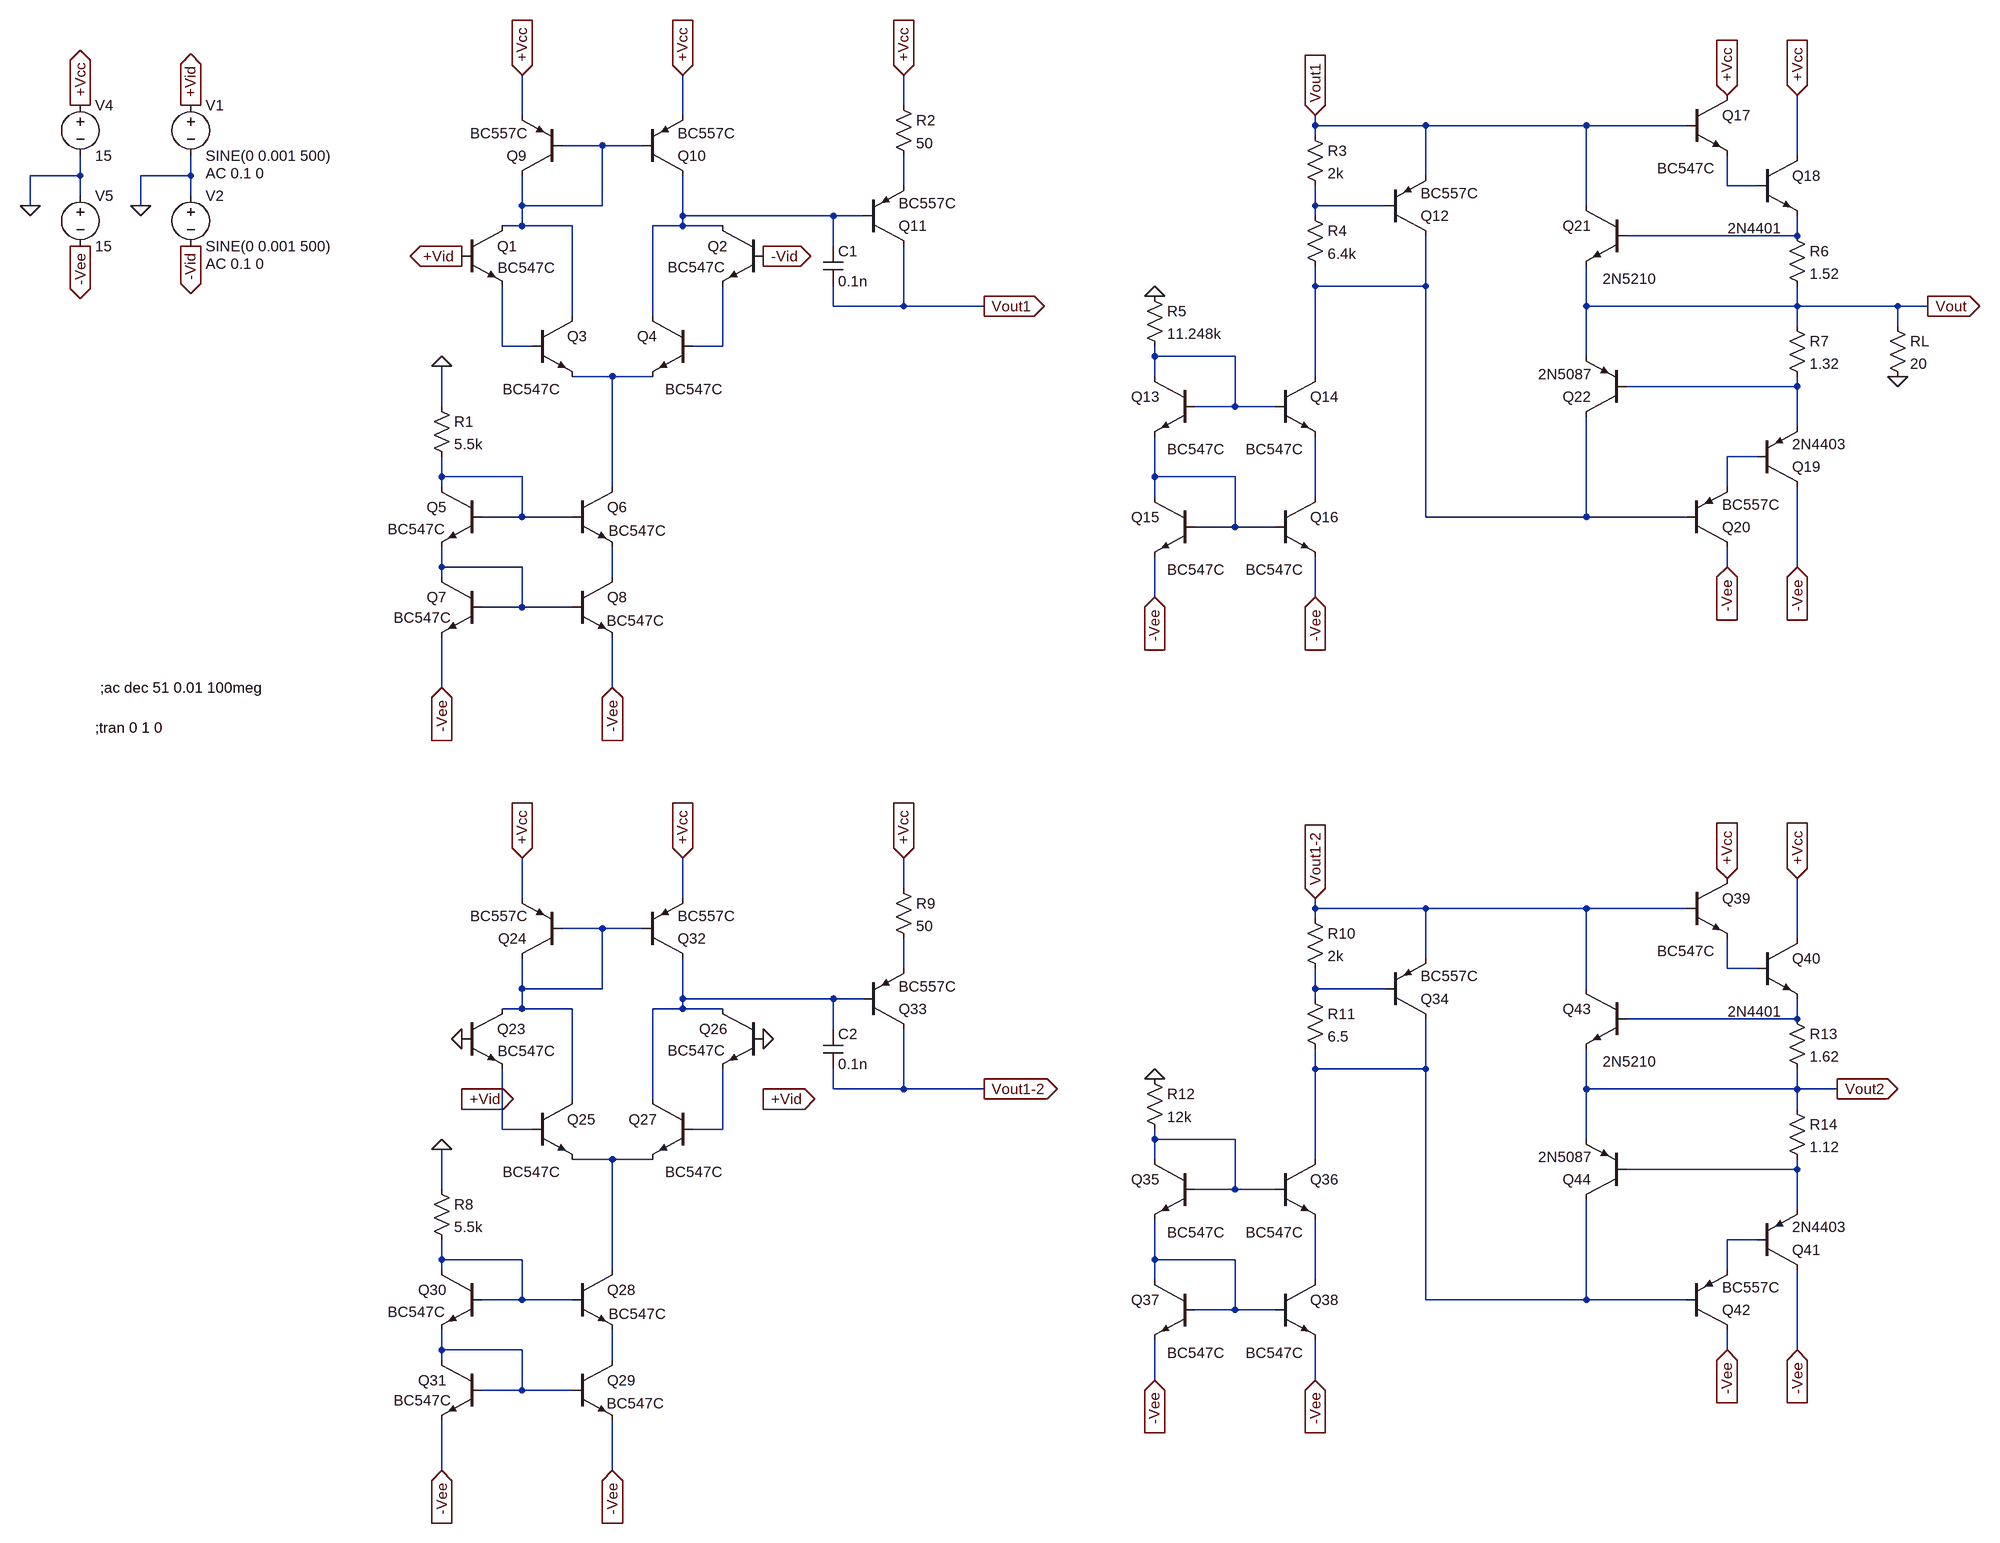
[diagram p0: schematic amplificador.asc]
amplificador.asc, the LTspice schematic file:
Version 4
SHEET 1 2160 3252
WIRE 288 944 288 896
WIRE -320 960 -320 896
WIRE -64 960 -64 896
WIRE 944 976 944 960
WIRE 1120 976 944 976
WIRE 1376 976 1120 976
WIRE 1536 976 1376 976
WIRE 944 992 944 976
WIRE -192 1008 -256 1008
WIRE -128 1008 -192 1008
WIRE 1712 1024 1712 928
WIRE -1024 1056 -1024 1024
WIRE -1024 1056 -1104 1056
WIRE -848 1056 -848 1024
WIRE -848 1056 -928 1056
WIRE 1120 1056 1120 976
WIRE 288 1072 288 1024
WIRE 1600 1072 1600 1024
WIRE 1648 1072 1600 1072
WIRE -1024 1088 -1024 1056
WIRE -848 1088 -848 1056
WIRE -1104 1104 -1104 1056
WIRE -928 1104 -928 1056
WIRE -320 1104 -320 1056
WIRE -192 1104 -192 1008
WIRE -192 1104 -320 1104
WIRE 944 1104 944 1072
WIRE 1056 1104 944 1104
WIRE 1376 1104 1376 976
WIRE -64 1120 -64 1056
WIRE 176 1120 -64 1120
WIRE 224 1120 176 1120
WIRE 944 1120 944 1104
WIRE -320 1136 -320 1104
WIRE -320 1136 -352 1136
WIRE -240 1136 -320 1136
WIRE -64 1136 -64 1120
WIRE -64 1136 -112 1136
WIRE 0 1136 -64 1136
WIRE 1712 1152 1712 1120
WIRE 1712 1152 1440 1152
WIRE 176 1168 176 1120
WIRE 944 1232 944 1200
WIRE 1120 1232 1120 1152
WIRE 1120 1232 944 1232
WIRE 176 1264 176 1232
WIRE 288 1264 288 1168
WIRE 288 1264 176 1264
WIRE 416 1264 288 1264
WIRE 1376 1264 1376 1200
WIRE 1712 1264 1712 1232
WIRE 1712 1264 1376 1264
WIRE 1872 1264 1712 1264
WIRE 1920 1264 1872 1264
WIRE -240 1280 -240 1136
WIRE -112 1280 -112 1136
WIRE 1712 1296 1712 1264
WIRE 1872 1296 1872 1264
WIRE -352 1328 -352 1232
WIRE -304 1328 -352 1328
WIRE 0 1328 0 1232
WIRE 0 1328 -48 1328
WIRE 688 1344 688 1328
WIRE 816 1344 688 1344
WIRE 1376 1344 1376 1264
WIRE -176 1376 -240 1376
WIRE -112 1376 -176 1376
WIRE 688 1376 688 1344
WIRE 944 1376 944 1232
WIRE 1712 1392 1712 1376
WIRE 1712 1392 1440 1392
WIRE -448 1424 -448 1360
WIRE 816 1424 816 1344
WIRE 816 1424 752 1424
WIRE 880 1424 816 1424
WIRE 1712 1456 1712 1392
WIRE 1648 1504 1600 1504
WIRE -448 1536 -448 1504
WIRE -320 1536 -448 1536
WIRE 688 1536 688 1472
WIRE 816 1536 688 1536
WIRE -448 1552 -448 1536
WIRE -176 1552 -176 1376
WIRE 1600 1552 1600 1504
WIRE 688 1568 688 1536
WIRE 944 1568 944 1472
WIRE -320 1600 -320 1536
WIRE -320 1600 -384 1600
WIRE -240 1600 -320 1600
WIRE 1120 1600 1120 1232
WIRE 1376 1600 1376 1440
WIRE 1376 1600 1120 1600
WIRE 1536 1600 1376 1600
WIRE 816 1616 816 1536
WIRE 816 1616 752 1616
WIRE 880 1616 816 1616
WIRE -448 1680 -448 1648
WIRE -320 1680 -448 1680
WIRE 1600 1680 1600 1648
WIRE 1712 1680 1712 1552
WIRE -448 1696 -448 1680
WIRE -176 1696 -176 1648
WIRE 688 1728 688 1664
WIRE 944 1728 944 1664
WIRE -320 1744 -320 1680
WIRE -320 1744 -384 1744
WIRE -240 1744 -320 1744
WIRE -448 1872 -448 1792
WIRE -176 1872 -176 1792
WIRE 288 2192 288 2144
WIRE -320 2208 -320 2144
WIRE -64 2208 -64 2144
WIRE 944 2224 944 2208
WIRE 1120 2224 944 2224
WIRE 1376 2224 1120 2224
WIRE 1536 2224 1376 2224
WIRE 944 2240 944 2224
WIRE -192 2256 -256 2256
WIRE -128 2256 -192 2256
WIRE 1712 2272 1712 2176
WIRE 1120 2304 1120 2224
WIRE 288 2320 288 2272
WIRE 1600 2320 1600 2272
WIRE 1648 2320 1600 2320
WIRE -320 2352 -320 2304
WIRE -192 2352 -192 2256
WIRE -192 2352 -320 2352
WIRE 944 2352 944 2320
WIRE 1056 2352 944 2352
WIRE 1376 2352 1376 2224
WIRE -64 2368 -64 2304
WIRE 176 2368 -64 2368
WIRE 224 2368 176 2368
WIRE 944 2368 944 2352
WIRE -320 2384 -320 2352
WIRE -320 2384 -352 2384
WIRE -240 2384 -320 2384
WIRE -64 2384 -64 2368
WIRE -64 2384 -112 2384
WIRE 0 2384 -64 2384
WIRE 1712 2400 1712 2368
WIRE 1712 2400 1440 2400
WIRE 176 2416 176 2368
WIRE 944 2480 944 2448
WIRE 1120 2480 1120 2400
WIRE 1120 2480 944 2480
WIRE 176 2512 176 2480
WIRE 288 2512 288 2416
WIRE 288 2512 176 2512
WIRE 416 2512 288 2512
WIRE 1376 2512 1376 2448
WIRE 1712 2512 1712 2480
WIRE 1712 2512 1376 2512
WIRE 1776 2512 1712 2512
WIRE -240 2528 -240 2384
WIRE -112 2528 -112 2384
WIRE 1712 2544 1712 2512
WIRE -352 2576 -352 2480
WIRE -304 2576 -352 2576
WIRE 0 2576 0 2480
WIRE 0 2576 -48 2576
WIRE 688 2592 688 2576
WIRE 816 2592 688 2592
WIRE 1376 2592 1376 2512
WIRE -176 2624 -240 2624
WIRE -112 2624 -176 2624
WIRE 688 2624 688 2592
WIRE 944 2624 944 2480
WIRE 1712 2640 1712 2624
WIRE 1712 2640 1440 2640
WIRE -448 2672 -448 2608
WIRE 816 2672 816 2592
WIRE 816 2672 752 2672
WIRE 880 2672 816 2672
WIRE 1712 2704 1712 2640
WIRE 1648 2752 1600 2752
WIRE -448 2784 -448 2752
WIRE -320 2784 -448 2784
WIRE 688 2784 688 2720
WIRE 816 2784 688 2784
WIRE -448 2800 -448 2784
WIRE -176 2800 -176 2624
WIRE 1600 2800 1600 2752
WIRE 688 2816 688 2784
WIRE 944 2816 944 2720
WIRE -320 2848 -320 2784
WIRE -320 2848 -384 2848
WIRE -240 2848 -320 2848
WIRE 1120 2848 1120 2480
WIRE 1376 2848 1376 2688
WIRE 1376 2848 1120 2848
WIRE 1536 2848 1376 2848
WIRE 816 2864 816 2784
WIRE 816 2864 752 2864
WIRE 880 2864 816 2864
WIRE -448 2928 -448 2896
WIRE -320 2928 -448 2928
WIRE 1600 2928 1600 2896
WIRE 1712 2928 1712 2800
WIRE -448 2944 -448 2928
WIRE -176 2944 -176 2896
WIRE 688 2976 688 2912
WIRE 944 2976 944 2912
WIRE -320 2992 -320 2928
WIRE -320 2992 -384 2992
WIRE -240 2992 -320 2992
WIRE -448 3120 -448 3040
WIRE -176 3120 -176 3040
FLAG -1024 1168 -Vee
IOPIN -1024 1168 Out
FLAG -1024 944 +Vcc
IOPIN -1024 944 Out
FLAG -448 1360 0
FLAG -64 896 +Vcc
IOPIN -64 896 In
FLAG 416 1264 Vout1
IOPIN 416 1264 Out
FLAG -848 1168 -Vid
IOPIN -848 1168 Out
FLAG -848 944 +Vid
IOPIN -848 944 Out
FLAG -928 1104 0
FLAG -1104 1104 0
FLAG -320 896 +Vcc
IOPIN -320 896 In
FLAG 288 896 +Vcc
IOPIN 288 896 In
FLAG -176 1872 -Vee
IOPIN -176 1872 In
FLAG -448 1872 -Vee
IOPIN -448 1872 In
FLAG 944 960 Vout1
IOPIN 944 960 In
FLAG 688 1248 0
FLAG 1712 928 +Vcc
IOPIN 1712 928 In
FLAG 1712 1680 -Vee
IOPIN 1712 1680 In
FLAG 1920 1264 Vout
IOPIN 1920 1264 Out
FLAG 944 1728 -Vee
IOPIN 944 1728 In
FLAG 688 1728 -Vee
IOPIN 688 1728 In
FLAG 1600 928 +Vcc
IOPIN 1600 928 In
FLAG 1600 1680 -Vee
IOPIN 1600 1680 In
FLAG -448 2608 0
FLAG -64 2144 +Vcc
IOPIN -64 2144 In
FLAG 416 2512 Vout1-2
IOPIN 416 2512 Out
FLAG -320 2144 +Vcc
IOPIN -320 2144 In
FLAG 288 2144 +Vcc
IOPIN 288 2144 In
FLAG -176 3120 -Vee
IOPIN -176 3120 In
FLAG -448 3120 -Vee
IOPIN -448 3120 In
FLAG 944 2208 Vout1-2
IOPIN 944 2208 In
FLAG 688 2496 0
FLAG 1712 2176 +Vcc
IOPIN 1712 2176 In
FLAG 1712 2928 -Vee
IOPIN 1712 2928 In
FLAG 1776 2512 Vout2
IOPIN 1776 2512 Out
FLAG 944 2976 -Vee
IOPIN 944 2976 In
FLAG 688 2976 -Vee
IOPIN 688 2976 In
FLAG 1600 2176 +Vcc
IOPIN 1600 2176 In
FLAG 1600 2928 -Vee
IOPIN 1600 2928 In
FLAG -416 1184 +Vid
IOPIN -416 1184 Out
FLAG 64 1184 -Vid
IOPIN 64 1184 Out
FLAG -416 2528 +Vid
IOPIN -416 2528 Out
FLAG 64 2528 +Vid
IOPIN 64 2528 Out
FLAG -416 2432 0
FLAG 64 2432 0
FLAG 1872 1376 0
SYMBOL npn -416 1136 R0
WINDOW 3 57 67 Left 2
SYMATTR Value BC547C
SYMATTR InstName Q1
SYMBOL pnp -256 1056 R180
SYMATTR InstName Q9
SYMATTR Value BC557C
SYMBOL voltage -1024 928 R0
WINDOW 123 0 0 Left 0
WINDOW 39 0 0 Left 0
SYMATTR InstName V4
SYMATTR Value 15
SYMBOL voltage -1024 1072 R0
WINDOW 123 0 0 Left 0
WINDOW 39 0 0 Left 0
SYMATTR InstName V5
SYMATTR Value 15
SYMBOL npn -304 1280 R0
WINDOW 3 -47 116 Left 2
SYMATTR Value BC547C
SYMATTR InstName Q3
SYMBOL npn 64 1136 M0
WINDOW 3 61 66 Left 2
SYMATTR Value BC547C
SYMATTR InstName Q2
SYMBOL npn -48 1280 M0
WINDOW 3 -47 116 Left 2
SYMATTR Value BC547C
SYMATTR InstName Q4
SYMBOL npn -240 1552 R0
WINDOW 3 58 70 Left 2
SYMATTR Value BC547C
SYMATTR InstName Q6
SYMBOL npn -240 1696 R0
WINDOW 3 55 69 Left 2
SYMATTR Value BC547C
SYMATTR InstName Q8
SYMBOL npn -384 1552 M0
WINDOW 3 59 67 Left 2
SYMATTR Value BC547C
SYMATTR InstName Q5
SYMBOL npn -384 1696 M0
WINDOW 3 50 64 Left 2
SYMATTR Value BC547C
SYMATTR InstName Q7
SYMBOL res -464 1408 R0
SYMATTR InstName R1
SYMATTR Value 5.5k
SYMBOL pnp -128 1056 M180
SYMATTR InstName Q10
SYMATTR Value BC557C
SYMBOL pnp 224 1168 M180
SYMATTR InstName Q11
SYMATTR Value BC557C
SYMBOL cap 160 1168 R0
SYMATTR InstName C1
SYMATTR Value 0.1n
SYMBOL res 272 928 R0
SYMATTR InstName R2
SYMATTR Value 50
SYMBOL voltage -848 928 R0
WINDOW 123 24 124 Left 2
WINDOW 39 0 0 Left 0
SYMATTR Value2 AC 0.1 0
SYMATTR InstName V1
SYMATTR Value SINE(0 0.001 500)
SYMBOL voltage -848 1072 R0
WINDOW 123 24 124 Left 2
WINDOW 39 0 0 Left 0
SYMATTR Value2 AC 0.1 0
SYMATTR InstName V2
SYMATTR Value SINE(0 0.001 500)
SYMBOL res 928 976 R0
SYMATTR InstName R3
SYMATTR Value 2k
SYMBOL res 928 1104 R0
SYMATTR InstName R4
SYMATTR Value 6.4k
SYMBOL pnp 1056 1152 M180
SYMATTR InstName Q12
SYMATTR Value BC557C
SYMBOL npn 752 1376 M0
WINDOW 3 -47 116 Left 2
SYMATTR Value BC547C
SYMATTR InstName Q13
SYMBOL npn 880 1376 R0
WINDOW 3 -47 116 Left 2
SYMATTR Value BC547C
SYMATTR InstName Q14
SYMBOL npn 752 1568 M0
WINDOW 3 -47 116 Left 2
SYMATTR Value BC547C
SYMATTR InstName Q15
SYMBOL npn 880 1568 R0
WINDOW 3 -47 116 Left 2
SYMATTR Value BC547C
SYMATTR InstName Q16
SYMBOL res 672 1232 R0
SYMATTR InstName R5
SYMATTR Value 11.248k
SYMBOL npn 1536 928 R0
WINDOW 3 -47 116 Left 2
SYMATTR Value BC547C
SYMATTR InstName Q17
SYMBOL npn 1648 1024 R0
WINDOW 3 -47 116 Left 2
SYMATTR Value 2N4401
SYMATTR InstName Q18
SYMBOL res 1696 1136 R0
SYMATTR InstName R6
SYMATTR Value 1.52
SYMBOL res 1696 1280 R0
SYMATTR InstName R7
SYMATTR Value 1.32
SYMBOL pnp 1648 1552 M180
SYMATTR InstName Q19
SYMATTR Value 2N4403
SYMBOL pnp 1536 1648 M180
SYMATTR InstName Q20
SYMATTR Value BC557C
SYMBOL npn 1440 1104 M0
WINDOW 3 -47 116 Left 2
SYMATTR Value 2N5210
SYMATTR InstName Q21
SYMBOL pnp 1440 1440 R180
SYMATTR InstName Q22
SYMATTR Value 2N5087
SYMBOL npn -416 2384 R0
WINDOW 3 57 67 Left 2
SYMATTR Value BC547C
SYMATTR InstName Q23
SYMBOL pnp -256 2304 R180
SYMATTR InstName Q24
SYMATTR Value BC557C
SYMBOL npn -304 2528 R0
WINDOW 3 -47 116 Left 2
SYMATTR Value BC547C
SYMATTR InstName Q25
SYMBOL npn 64 2384 M0
WINDOW 3 61 66 Left 2
SYMATTR Value BC547C
SYMATTR InstName Q26
SYMBOL npn -48 2528 M0
WINDOW 3 -47 116 Left 2
SYMATTR Value BC547C
SYMATTR InstName Q27
SYMBOL npn -240 2800 R0
WINDOW 3 58 70 Left 2
SYMATTR Value BC547C
SYMATTR InstName Q28
SYMBOL npn -240 2944 R0
WINDOW 3 55 69 Left 2
SYMATTR Value BC547C
SYMATTR InstName Q29
SYMBOL npn -384 2800 M0
WINDOW 3 59 67 Left 2
SYMATTR Value BC547C
SYMATTR InstName Q30
SYMBOL npn -384 2944 M0
WINDOW 3 50 64 Left 2
SYMATTR Value BC547C
SYMATTR InstName Q31
SYMBOL res -464 2656 R0
SYMATTR InstName R8
SYMATTR Value 5.5k
SYMBOL pnp -128 2304 M180
SYMATTR InstName Q32
SYMATTR Value BC557C
SYMBOL pnp 224 2416 M180
SYMATTR InstName Q33
SYMATTR Value BC557C
SYMBOL cap 160 2416 R0
SYMATTR InstName C2
SYMATTR Value 0.1n
SYMBOL res 272 2176 R0
SYMATTR InstName R9
SYMATTR Value 50
SYMBOL res 928 2224 R0
SYMATTR InstName R10
SYMATTR Value 2k
SYMBOL res 928 2352 R0
SYMATTR InstName R11
SYMATTR Value 6.5
SYMBOL pnp 1056 2400 M180
SYMATTR InstName Q34
SYMATTR Value BC557C
SYMBOL npn 752 2624 M0
WINDOW 3 -47 116 Left 2
SYMATTR Value BC547C
SYMATTR InstName Q35
SYMBOL npn 880 2624 R0
WINDOW 3 -47 116 Left 2
SYMATTR Value BC547C
SYMATTR InstName Q36
SYMBOL npn 752 2816 M0
WINDOW 3 -47 116 Left 2
SYMATTR Value BC547C
SYMATTR InstName Q37
SYMBOL npn 880 2816 R0
WINDOW 3 -47 116 Left 2
SYMATTR Value BC547C
SYMATTR InstName Q38
SYMBOL res 672 2480 R0
SYMATTR InstName R12
SYMATTR Value 12k
SYMBOL npn 1536 2176 R0
WINDOW 3 -47 116 Left 2
SYMATTR Value BC547C
SYMATTR InstName Q39
SYMBOL npn 1648 2272 R0
WINDOW 3 -47 116 Left 2
SYMATTR Value 2N4401
SYMATTR InstName Q40
SYMBOL res 1696 2384 R0
SYMATTR InstName R13
SYMATTR Value 1.62
SYMBOL res 1696 2528 R0
SYMATTR InstName R14
SYMATTR Value 1.12
SYMBOL pnp 1648 2800 M180
SYMATTR InstName Q41
SYMATTR Value 2N4403
SYMBOL pnp 1536 2896 M180
SYMATTR InstName Q42
SYMATTR Value BC557C
SYMBOL npn 1440 2352 M0
WINDOW 3 -47 116 Left 2
SYMATTR Value 2N5210
SYMATTR InstName Q43
SYMBOL pnp 1440 2688 R180
SYMATTR InstName Q44
SYMATTR Value 2N5087
SYMBOL res 1856 1280 R0
SYMATTR InstName RL
SYMATTR Value 20
TEXT -1000 1936 Left 2 !;tran 0 1 0
TEXT -992 1872 Left 2 !;ac dec 51 0.01 100meg

The netlist it stands for:
* amplificador.asc
Q1 N001 +Vid N008 0 BC547C
Q9 N001 N001 +Vcc 0 BC557C
V4 +Vcc 0 15
V5 0 -Vee 15
Q3 N001 N008 N011 0 BC547C
Q2 N005 -Vid N009 0 BC547C
Q4 N005 N009 N011 0 BC547C
Q6 N011 N014 N018 0 BC547C
Q8 N018 N017 -Vee 0 BC547C
Q5 N014 N014 N017 0 BC547C
Q7 N017 N017 -Vee 0 BC547C
R1 0 N014 5.5k
Q10 N005 N001 +Vcc 0 BC557C
Q11 Vout1 N005 N002 0 BC557C
C1 N005 Vout1 0.1n
R2 +Vcc N002 50
V1 +Vid 0 SINE(0 0.001 500) AC 0.1 0
V2 0 -Vid SINE(0 0.001 500) AC 0.1 0
R3 Vout1 N004 2k
R4 N004 N007 6.4k
Q12 N007 N004 Vout1 0 BC557C
Q13 N010 N010 N015 0 BC547C
Q14 N007 N010 N016 0 BC547C
Q15 N015 N015 -Vee 0 BC547C
Q16 N016 N015 -Vee 0 BC547C
R5 0 N010 11.248k
Q17 +Vcc Vout1 N003 0 BC547C
Q18 +Vcc N003 N006 0 2N4401
R6 N006 Vout 1.52
R7 Vout N012 1.32
Q19 -Vee N013 N012 0 2N4403
Q20 -Vee N007 N013 0 BC557C
Q21 Vout1 N006 Vout 0 2N5210
Q22 N007 N012 Vout 0 2N5087
Q23 N019 0 N026 0 BC547C
Q24 N019 N019 +Vcc 0 BC557C
Q25 N019 N026 N029 0 BC547C
Q26 N023 0 N027 0 BC547C
Q27 N023 N027 N029 0 BC547C
Q28 N029 N032 N036 0 BC547C
Q29 N036 N035 -Vee 0 BC547C
Q30 N032 N032 N035 0 BC547C
Q31 N035 N035 -Vee 0 BC547C
R8 0 N032 5.5k
Q32 N023 N019 +Vcc 0 BC557C
Q33 Vout1-2 N023 N020 0 BC557C
C2 N023 Vout1-2 0.1n
R9 +Vcc N020 50
R10 Vout1-2 N022 2k
R11 N022 N025 6.5
Q34 N025 N022 Vout1-2 0 BC557C
Q35 N028 N028 N033 0 BC547C
Q36 N025 N028 N034 0 BC547C
Q37 N033 N033 -Vee 0 BC547C
Q38 N034 N033 -Vee 0 BC547C
R12 0 N028 12k
Q39 +Vcc Vout1-2 N021 0 BC547C
Q40 +Vcc N021 N024 0 2N4401
R13 N024 Vout2 1.62
R14 Vout2 N030 1.12
Q41 -Vee N031 N030 0 2N4403
Q42 -Vee N025 N031 0 BC557C
Q43 Vout1-2 N024 Vout2 0 2N5210
Q44 N025 N030 Vout2 0 2N5087
RL Vout 0 20
.model NPN NPN
.model PNP PNP
.lib standard.bjt
;tran 0 1 0
;ac dec 51 0.01 100meg
.backanno
.end